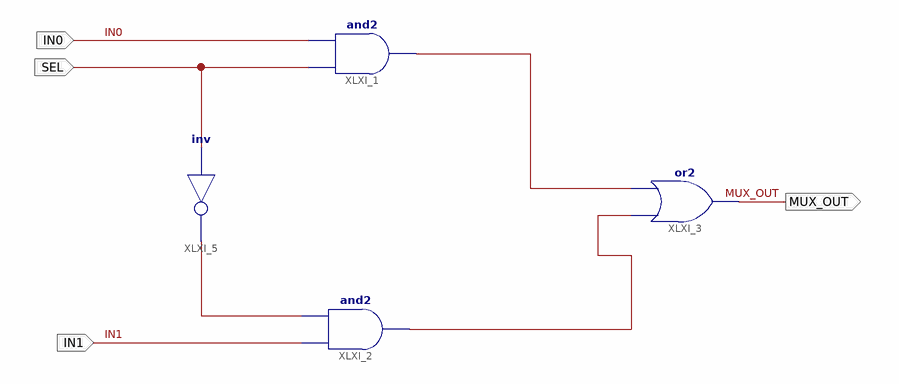
[diagram p0: schematic sheet 1]
// Xilinx ISE schematic mux.sch (spartan3e) as structural Verilog: 4 symbols, 4 ports
module mux (
  input  IN1,
  input  IN0,
  input  SEL,
  output MUX_OUT
);

  wire XLXN_7, XLXN_13, XLXN_14;

  and XLXI_1 (XLXN_7, SEL, IN0);
  and XLXI_2 (XLXN_13, IN1, XLXN_14);
  or XLXI_3 (MUX_OUT, XLXN_13, XLXN_7);
  not XLXI_5 (XLXN_14, SEL);
endmodule
